# Altium schematic sheet Mixers.SchDoc
size A; SheetNumber: 2; SheetTotal: 9
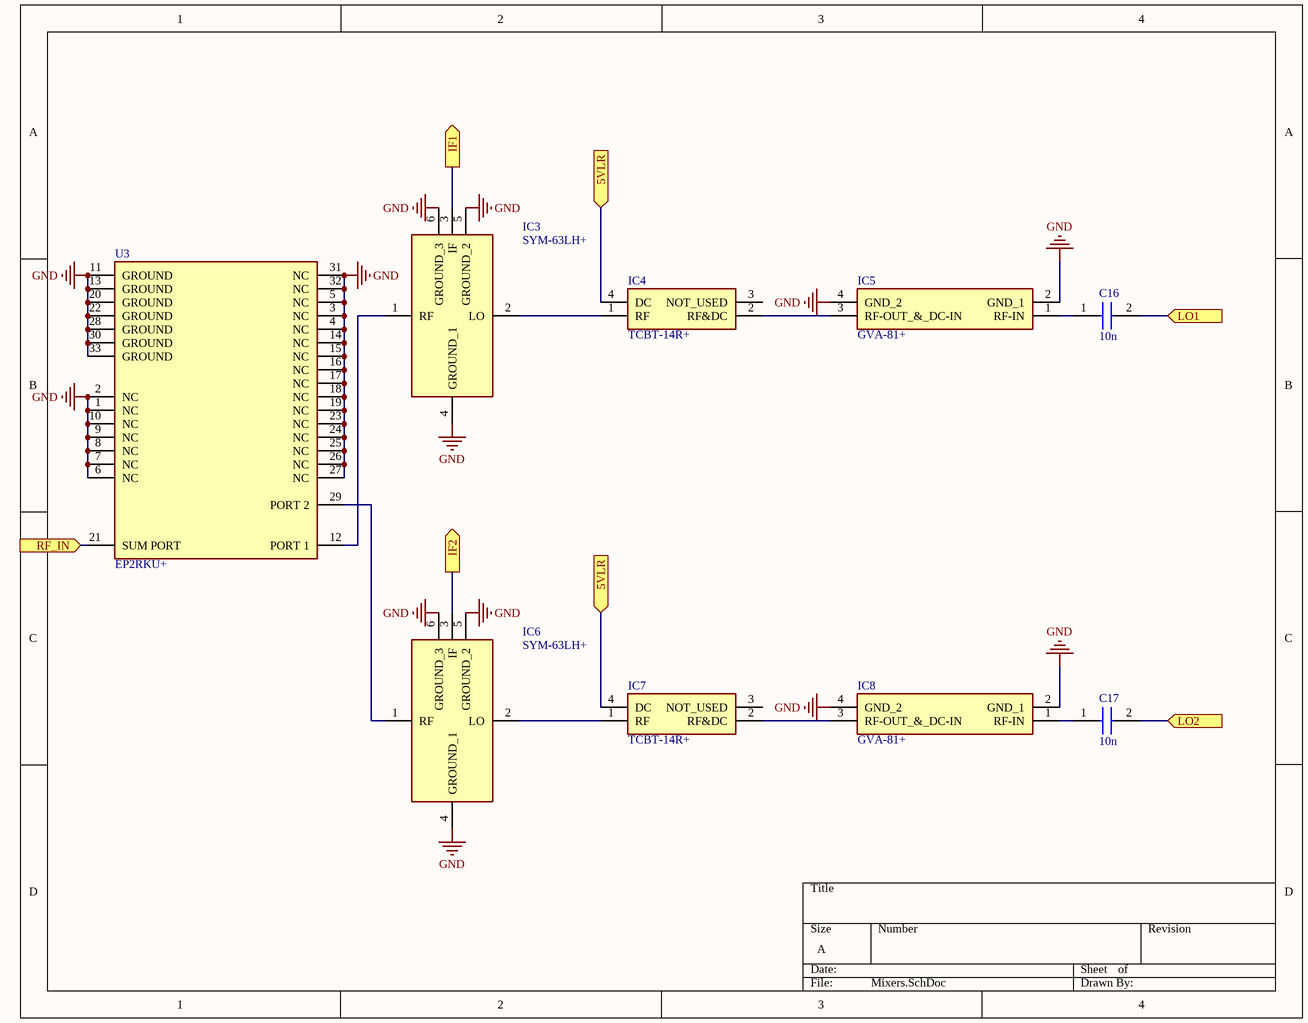
[diagram p0: Mixers.SchDoc]

## Parts
C16  10n  [CAPC1005X61N]
C17  10n  [CAPC1005X61N]
IC3  SYM-63LH+  [SYM63LH]
IC4  TCBT-14R+  [TCBT14R]
IC5  GVA-81+  [GVA63]
IC6  SYM-63LH+  [SYM63LH]
IC7  TCBT-14R+  [TCBT14R]
IC8  GVA-81+  [GVA63]
U3  EP2RKU+  [FP-EP2RKU+-MFG]

## Ports
5VLR (in), IF1 (out), IF2 (out), LO1 (in), LO2 (in), RF_IN (in)

## Nets
GND: IC3.4(GROUND_1) IC3.5(GROUND_2) IC3.6(GROUND_3) IC5.2(GND_1) IC5.4(GND_2) IC6.4(GROUND_1) IC6.5(GROUND_2) IC6.6(GROUND_3) IC8.2(GND_1) IC8.4(GND_2) U3.1(NC) U3.2(NC) U3.3(NC) U3.4(NC) U3.5(NC) U3.6(NC) U3.7(NC) U3.8(NC) U3.9(NC) U3.10(NC) U3.11(GROUND) U3.13(GROUND) U3.14(NC) U3.15(NC) U3.16(NC) U3.17(NC) U3.18(NC) U3.19(NC) U3.20(GROUND) U3.22(GROUND) U3.23(NC) U3.24(NC) U3.25(NC) U3.26(NC) U3.27(NC) U3.28(GROUND) U3.30(GROUND) U3.31(NC) U3.32(NC) U3.33(GROUND)
5VLR: IC4.4(DC) IC7.4(DC) ; port 5VLR
IF1: IC3.3(IF) ; port IF1
IF2: IC6.3(IF) ; port IF2
LO1: C16.2 ; port LO1
LO2: C17.2 ; port LO2
RF_IN: U3.21(SUM_PORT) ; port RF_IN
NetC16_1: C16.1 IC5.1(RF-IN)
NetC17_1: C17.1 IC8.1(RF-IN)
NetIC3_1: IC3.1(RF) U3.12(PORT_1)
NetIC3_2: IC3.2(LO) IC4.1(RF)
NetIC4_2: IC4.2(RF&DC) IC5.3(RF-OUT_&_DC-IN)
NetIC6_1: IC6.1(RF) U3.29(PORT_2)
NetIC6_2: IC6.2(LO) IC7.1(RF)
NetIC7_2: IC7.2(RF&DC) IC8.3(RF-OUT_&_DC-IN)

Not connected (* = marked no-connect by the designer): IC4 3(NOT_USED); IC7 3(NOT_USED)

## Library data of the parts
C16 C17 = 520L103KT16T: Capacitor; Manufacturer_Name: ATC / Kyocera AVX; Datasheet Link: https://rfs.kyocera-avx.com/userFiles/uploads/pdfs/520l.pdf; Height: 0.61mm; Manufacturer_Part_Number: 520L103KT16T; Mouser Part Number: 581-520L103KT16T; Mouser Price/Stock: https://www.mouser.co.uk/ProductDetail/ATC-KYOCERA-AVX/520L103KT16T?qs=1tb21EFCQjo0F0Wws%2FObWA%3D%3D
IC3 IC6 = SYM-63LH+: Integrated Circuit; Manufacturer_Name: Mini-Circuits; Datasheet Link: https://www.minicircuits.com/case_style/TTT166.pdf; Height: 3.82mm; Manufacturer_Part_Number: SYM-63LH+; Mouser Part Number: 139-SYM-63LH; Mouser Price/Stock: https://www.mouser.co.uk/ProductDetail/Mini-Circuits/SYM-63LH%2b?qs=xZ%2FP%252Ba9zWqZ%252BsdBVtVbUEA%3D%3D
IC4 IC7 = TCBT-14R+: Integrated Circuit; Manufacturer_Name: Mini-Circuits; Datasheet Link: https://www.minicircuits.com/pdfs/TCBT-14R+.pdf; Manufacturer_Part_Number: TCBT-14R+; Mouser Part Number: 139-TCBT-14R; Mouser Price/Stock: https://www.mouser.co.uk/ProductDetail/Mini-Circuits/TCBT-14R%2b?qs=xZ%2FP%252Ba9zWqaAUsoP1T4TSg%3D%3D
IC5 IC8 = GVA-81+: Integrated Circuit; Manufacturer_Name: Mini-Circuits; Datasheet Link: https://www.minicircuits.com/pdfs/GVA-81+.pdf; Height: 1mm; Manufacturer_Part_Number: GVA-81+; Mouser Part Number: 139-GVA-81; Mouser Price/Stock: https://www.mouser.co.uk/ProductDetail/Mini-Circuits/GVA-81%2b?qs=xZ%2FP%252Ba9zWqaubdVvazP9nQ%3D%3D
U3 = CMP-199890-000004-1: EP2RKU+ 2 Ways MMIC Power Splitter, DC - 18000 MHz, 50Ω